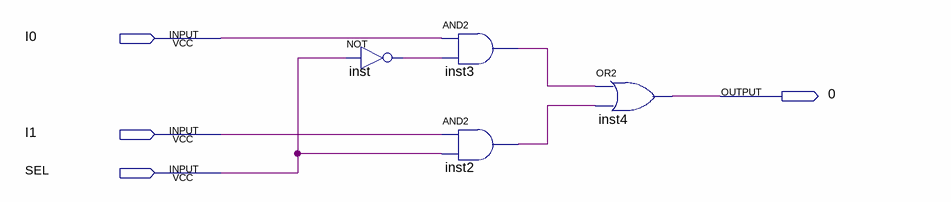
[diagram p0: schematic sheet]
// Quartus schematic mux2_1.bdf as structural Verilog: 4 symbols, 4 pins
module mux2_1 (
  input  I0,
  input  I1,
  input  SEL,
  output \0 
);

  wire inst2_out, inst3_out, inst_out;

  not inst (inst_out, SEL);
  and inst3 (inst3_out, I0, inst_out);
  and inst2 (inst2_out, I1, SEL);
  or inst4 (\0 , inst3_out, inst2_out);
endmodule
